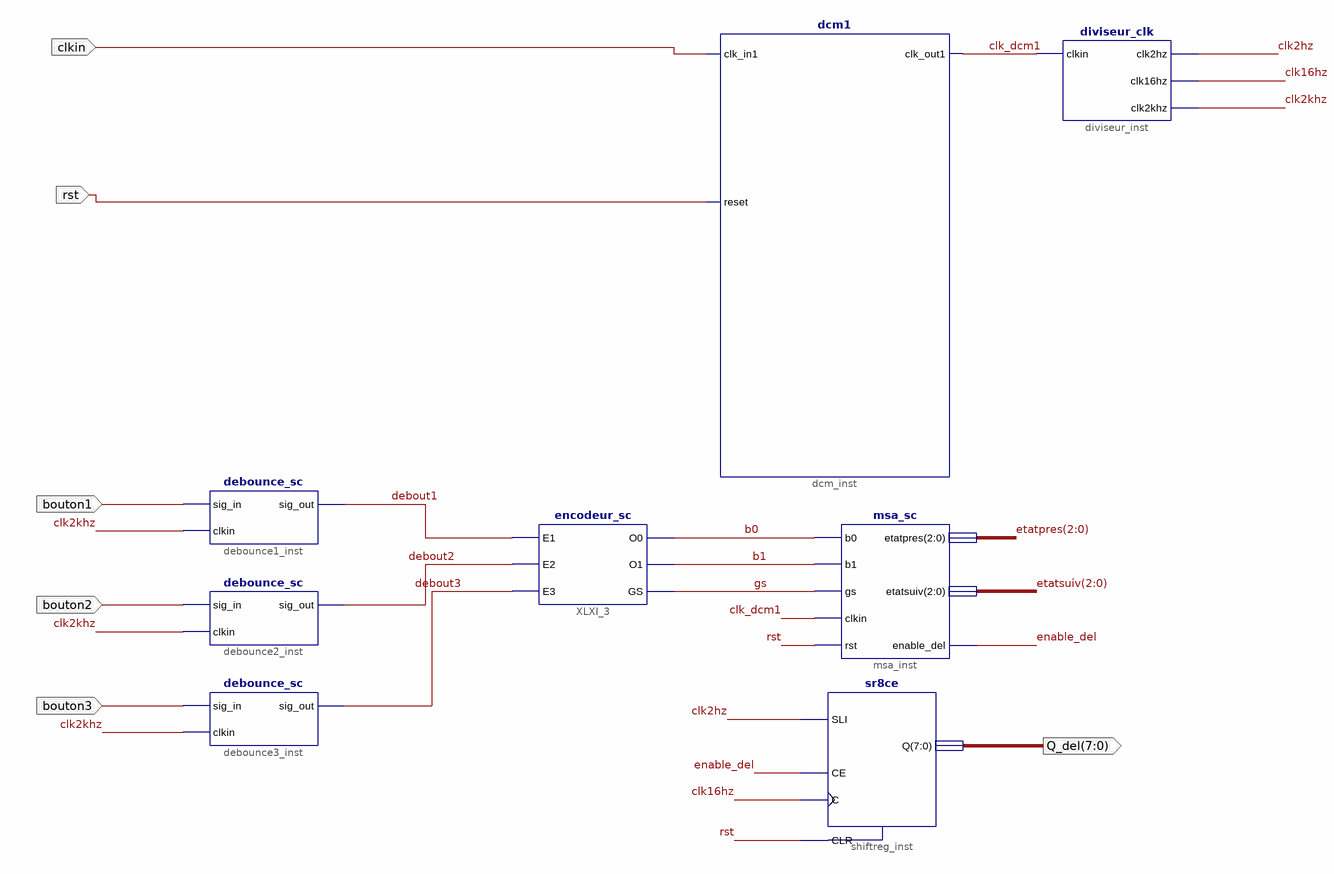
[diagram p0: schematic sheet 1]
// Xilinx ISE schematic didact_top.sch (spartan6) as structural Verilog: 8 symbols, 6 ports
module didact_top (
  input  clkin,
  input  rst,
  input  bouton1,
  input  bouton2,
  input  bouton3,
  output [7:0] Q_del
);

  wire b0, b1, clk2hz, clk2khz, clk16hz, clk_dcm1, debout1, debout2, debout3, enable_del, gs;
  wire [2:0] etatpres, etatsuiv;

  diviseur_clk diviseur_inst (.clkin(clk_dcm1), .clk2hz(clk2hz), .clk16hz(clk16hz), .clk2khz(clk2khz));
  msa_sc msa_inst (
    .b0(b0), .b1(b1), .gs(gs), .clkin(clk_dcm1), .rst(rst), .etatpres(etatpres), .etatsuiv(etatsuiv),
    .enable_del(enable_del));
  sr8ce shiftreg_inst (.C(clk16hz), .CE(enable_del), .CLR(rst), .SLI(clk2hz), .Q(Q_del));
  debounce_sc debounce3_inst (.sig_in(bouton3), .clkin(clk2khz), .sig_out(debout3));
  debounce_sc debounce2_inst (.sig_in(bouton2), .clkin(clk2khz), .sig_out(debout2));
  debounce_sc debounce1_inst (.sig_in(bouton1), .clkin(clk2khz), .sig_out(debout1));
  encodeur_sc XLXI_3 (.E3(debout3), .E2(debout2), .E1(debout1), .O0(b0), .O1(b1), .GS(gs));
  dcm1 dcm_inst (.clk_in1(clkin), .reset(rst), .clk_out1(clk_dcm1));
endmodule
